# Altium project Module-Wireless.PrjPcb
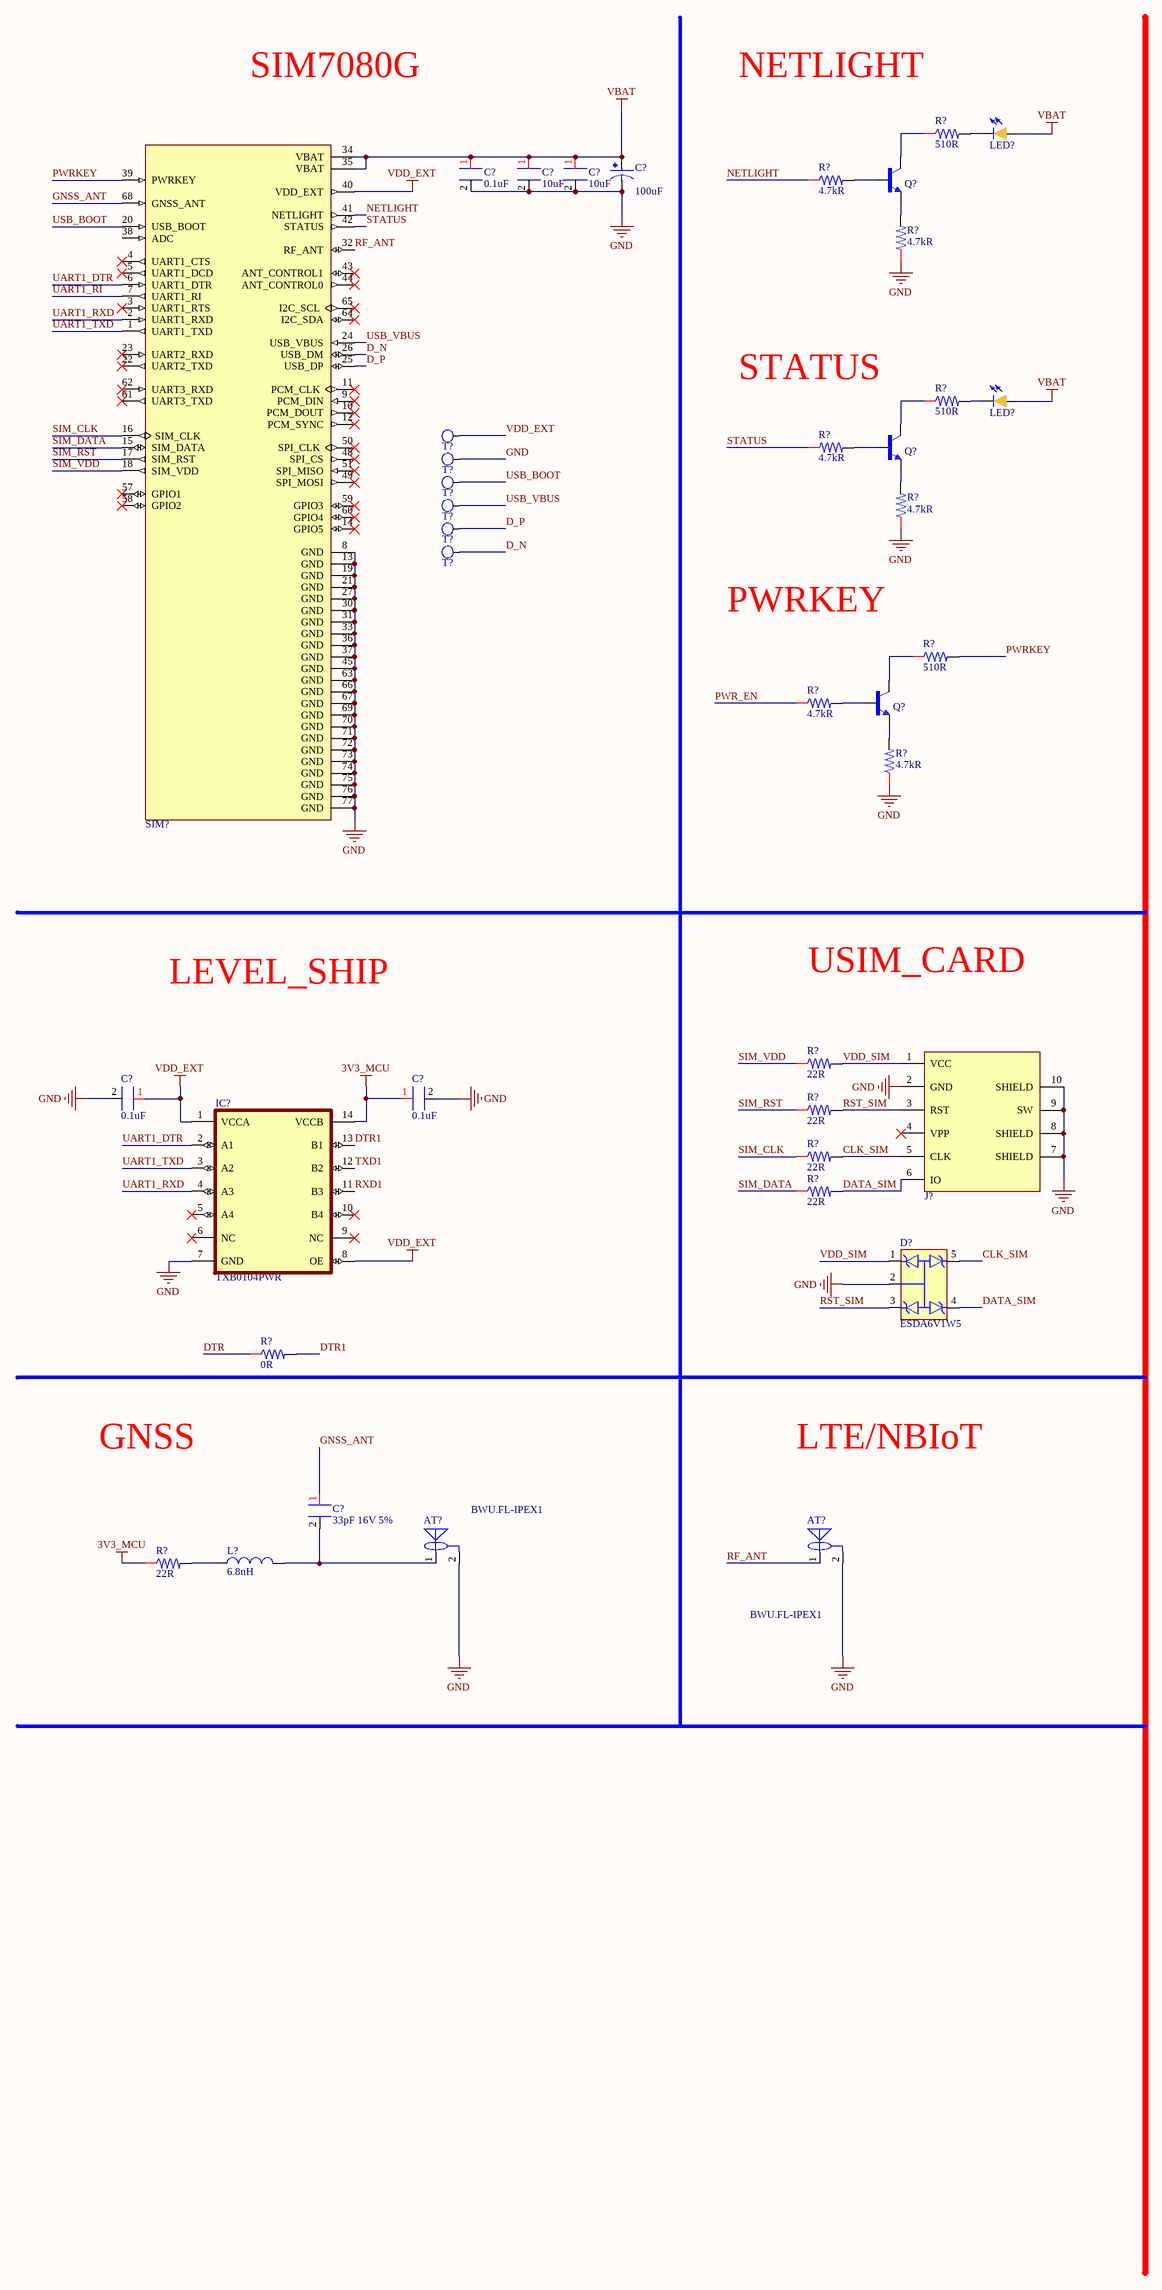
[diagram p0: Module-Wireless.SchDoc]
1 sheet, 40 parts. Net scope: global (net labels, ports and power ports of the same name join across sheets).
Board file: Module-Wireless.PcbDoc

## Sheet Module-Wireless.SchDoc
size D; SheetNumber: 1; SheetTotal: 1

### Parts
(Parts that share a designator on the sheet are numbered #1, #2 ... from top to bottom, then left to right.)
AT?#1  BWU.FL-IPEX1  [IPEX-SMD_BWIPX-1-001E]
AT?#2  BWU.FL-IPEX1  [IPEX-SMD_BWIPX-1-001E]
C?#1  value 0.1uF  [CAP_0603_KEMET]  (hidden comment: 0.1 µF ±20% 50V Ceramic Capacitor X7R 0603 (1608 Metric))
C?#2  value 10uF  [CAP_0603_YAGEO]  (hidden comment: 10 µF ±20% 10V Ceramic Capacitor X5R 0603 (1608 Metric))
C?#3  value 10uF  [CAP_0603_YAGEO]  (hidden comment: 10 µF ±20% 10V Ceramic Capacitor X5R 0603 (1608 Metric))
C?#4  value 100uF  [SMD_DxLxW=6.3x6.6x6.6mm]  (hidden comment: 100 µF 16 V Aluminum Electrolytic Capacitors Radial, Can - SMD 2000 Hrs @ 125°C)
C?#5  value 0.1uF  [CAP_0603_KEMET]  (hidden comment: 0.1 µF ±20% 50V Ceramic Capacitor X7R 0603 (1608 Metric))
C?#6  value 0.1uF  [CAP_0603_KEMET]  (hidden comment: 0.1 µF ±20% 50V Ceramic Capacitor X7R 0603 (1608 Metric))
C?#7  value 33pF 16V 5%  [0603_WURTH ELECTRONIK]  (hidden comment: 885012006020)
D?  Manufacturer Part Number: ESDA6V1W5  [SOT-323-5]  (hidden comment: TVS DIODE 3VWM SOT3235)
IC?  Manufacturer Part Number: TXB0104PWR  [14-TSSOP]  (hidden comment: Voltage Level Translator Bidirectional 1 Circuit 4 Channel 100Mbps 14-TSSOP)
J?  6 Position Card Connector NANO SIM Surface Mount, Right Angle Gold  [NANO-SIM8060]  (value not drawn)
L?  value 6.8nH  [IND_0603_TAIYO_YUDEN]  (hidden comment: 6.8 nH Unshielded Multilayer Inductor 250 mA 390mOhm Max 0201 (0603 Metric))
LED?#1  Yellow-Green 572nm LED Indication - Discrete 2.2V 0603 (1608 Metric)  [LED_0603_ROHM]  (value not drawn)
LED?#2  Yellow-Green 572nm LED Indication - Discrete 2.2V 0603 (1608 Metric)  [LED_0603_ROHM]  (value not drawn)
Q?#1  Bipolar (BJT) Transistor NPN 40 V 200 mA 300MHz 350 mW Surface Mount SOT-23  [SOT-23-3/SC-59]  (value not drawn)
Q?#2  Bipolar (BJT) Transistor NPN 40 V 200 mA 300MHz 350 mW Surface Mount SOT-23  [SOT-23-3/SC-59]  (value not drawn)
Q?#3  Bipolar (BJT) Transistor NPN 40 V 200 mA 300MHz 350 mW Surface Mount SOT-23  [SOT-23-3/SC-59]  (value not drawn)
R?#1  value 510R  [0603_YAGEO]  (hidden comment: 510 Ohms ±1% 0.1W, 1/10W Chip Resistor 0603 (1608 Metric) Moisture Resistant Thick Film)
R?#2  value 4.7kR  [0603_YAGEO]  (hidden comment: 4.7 kOhms ±1% 0.1W, 1/10W Chip Resistor 0603 (1608 Metric) Moisture Resistant Thick Film)
R?#3  value 4.7kR  [0603_YAGEO]  (hidden comment: 4.7 kOhms ±1% 0.1W, 1/10W Chip Resistor 0603 (1608 Metric) Moisture Resistant Thick Film)
R?#4  value 510R  [0603_YAGEO]  (hidden comment: 510 Ohms ±1% 0.1W, 1/10W Chip Resistor 0603 (1608 Metric) Moisture Resistant Thick Film)
R?#5  value 4.7kR  [0603_YAGEO]  (hidden comment: 4.7 kOhms ±1% 0.1W, 1/10W Chip Resistor 0603 (1608 Metric) Moisture Resistant Thick Film)
R?#6  value 4.7kR  [0603_YAGEO]  (hidden comment: 4.7 kOhms ±1% 0.1W, 1/10W Chip Resistor 0603 (1608 Metric) Moisture Resistant Thick Film)
R?#7  value 510R  [0603_YAGEO]  (hidden comment: 510 Ohms ±1% 0.1W, 1/10W Chip Resistor 0603 (1608 Metric) Moisture Resistant Thick Film)
R?#8  value 4.7kR  [0603_YAGEO]  (hidden comment: 4.7 kOhms ±1% 0.1W, 1/10W Chip Resistor 0603 (1608 Metric) Moisture Resistant Thick Film)
R?#9  value 4.7kR  [0603_YAGEO]  (hidden comment: 4.7 kOhms ±1% 0.1W, 1/10W Chip Resistor 0603 (1608 Metric) Moisture Resistant Thick Film)
R?#10  value 22R  [0603_KOA]  (hidden comment: 22 Ohms ±1% 0.1W, 1/10W Chip Resistor 0603 (1608 Metric) Automotive AEC-Q200 Thick Film)
R?#11  value 22R  [0603_KOA]  (hidden comment: 22 Ohms ±1% 0.1W, 1/10W Chip Resistor 0603 (1608 Metric) Automotive AEC-Q200 Thick Film)
R?#12  value 22R  [0603_KOA]  (hidden comment: 22 Ohms ±1% 0.1W, 1/10W Chip Resistor 0603 (1608 Metric) Automotive AEC-Q200 Thick Film)
R?#13  value 22R  [0603_KOA]  (hidden comment: 22 Ohms ±1% 0.1W, 1/10W Chip Resistor 0603 (1608 Metric) Automotive AEC-Q200 Thick Film)
R?#14  value 0R  [0603_YAGEO]  (hidden comment: 0 Ohms Jumper Chip Resistor 0603 (1608 Metric) Moisture Resistant Thick Film)
R?#15  value 22R  [0603_KOA]  (hidden comment: 22 Ohms ±1% 0.1W, 1/10W Chip Resistor 0603 (1608 Metric) Automotive AEC-Q200 Thick Film)
SIM?  RF TXRX MOD CELL NAV SMD  [SIM7080G]  (value not drawn)
T?#1  TP  [TP_TH_1.0/1.5MM]  (value not drawn)  (no BOM)
T?#2  TP  [TP_TH_1.0/1.5MM]  (value not drawn)  (no BOM)
T?#3  TP  [TP_TH_1.0/1.5MM]  (value not drawn)  (no BOM)
T?#4  TP  [TP_TH_1.0/1.5MM]  (value not drawn)  (no BOM)
T?#5  TP  [TP_TH_1.0/1.5MM]  (value not drawn)  (no BOM)
T?#6  TP  [TP_TH_1.0/1.5MM]  (value not drawn)  (no BOM)

### Nets
3V3_MCU: C?#6.1 IC?.14(VCCB) R?#15.1
GND: AT?#1.2 AT?#2.2 C?#1.2 C?#2.2 C?#3.2 C?#4.2 C?#5.2 C?#6.2 D?.2 IC?.7(GND) J?.2(GND) J?.7(SHIELD) J?.8(SHIELD) J?.9(SW) J?.10(SHIELD) R?#3.1 R?#6.1 R?#9.1 SIM?.8(GND) SIM?.13(GND) SIM?.19(GND) SIM?.21(GND) SIM?.27(GND) SIM?.30(GND) SIM?.31(GND) SIM?.33(GND) SIM?.36(GND) SIM?.37(GND) SIM?.45(GND) SIM?.63(GND) SIM?.66(GND) SIM?.67(GND) SIM?.69(GND) SIM?.70(GND) SIM?.71(GND) SIM?.72(GND) SIM?.73(GND) SIM?.74(GND) SIM?.75(GND) SIM?.76(GND) SIM?.77(GND) T?#2.1
VBAT: C?#1.1 C?#2.1 C?#3.1 C?#4.1 LED?#1.A LED?#2.A SIM?.34(VBAT) SIM?.35(VBAT)
VDD_EXT: C?#5.1 IC?.1(VCCA) IC?.8(OE) SIM?.40(VDD_EXT) T?#1.1
CLK_SIM: D?.5 J?.5(CLK) R?#12.2
D_N: SIM?.26(USB_DM) T?#6.1
D_P: SIM?.25(USB_DP) T?#5.1
DATA_SIM: D?.4 J?.6(IO) R?#13.2
DTR: R?#14.1
DTR1: IC?.13(B1) R?#14.2
GNSS_ANT: C?#7.1 SIM?.68(GNSS_ANT)
NETLIGHT: R?#2.1 SIM?.41(NETLIGHT)
PWR_EN: R?#8.1
PWRKEY: R?#7.2 SIM?.39(PWRKEY)
RF_ANT: AT?#2.1 SIM?.32(RF_ANT)
RST_SIM: D?.3 J?.3(RST) R?#11.2
RXD1: IC?.11(B3)
SIM_CLK: R?#12.1 SIM?.16(SIM_CLK)
SIM_DATA: R?#13.1 SIM?.15(SIM_DATA)
SIM_RST: R?#11.1 SIM?.17(SIM_RST)
SIM_VDD: R?#10.1 SIM?.18(SIM_VDD)
STATUS: R?#5.1 SIM?.42(STATUS)
TXD1: IC?.12(B2)
UART1_DTR: IC?.2(A1) SIM?.6(UART1_DTR)
UART1_RI: SIM?.7(UART1_RI)
UART1_RXD: IC?.4(A3) SIM?.2(UART1_RXD)
UART1_TXD: IC?.3(A2) SIM?.1(UART1_TXD)
USB_BOOT: SIM?.20(USB_BOOT) T?#3.1
USB_VBUS: SIM?.24(USB_VBUS) T?#4.1
VDD_SIM: D?.1 J?.1(VCC) R?#10.2
NetAT?#1_1: AT?#1.1 C?#7.2 L?.2
NetL?_1: L?.1 R?#15.2
NetLED?#1_C: LED?#1.C R?#1.2
NetLED?#2_C: LED?#2.C R?#4.2
NetQ?#1_1: Q?#1.1(B) R?#2.2
NetQ?#1_2: Q?#1.2(E) R?#3.2
NetQ?#1_3: Q?#1.3(C) R?#1.1
NetQ?#2_1: Q?#2.1(B) R?#5.2
NetQ?#2_2: Q?#2.2(E) R?#6.2
NetQ?#2_3: Q?#2.3(C) R?#4.1
NetQ?#3_1: Q?#3.1(B) R?#8.2
NetQ?#3_2: Q?#3.2(E) R?#9.2
NetQ?#3_3: Q?#3.3(C) R?#7.1

Not connected (* = marked no-connect by the designer): IC? 5(A4)* 6(NC)* 9(NC)* 10(B4)*; J? 4(VPP)*; SIM? 3(UART1_RTS)* 4(UART1_CTS)* 5(UART1_DCD)* 9(PCM_DIN)* 10(PCM_DOUT)* 11(PCM_CLK)* 12(PCM_SYNC)* 14(GPIO5)* 22(UART2_TXD)* 23(UART2_RXD)* 38(ADC) 43(ANT_CONTROL1)* 44(ANT_CONTROL0)* 48(SPI_CS)* 49(SPI_MOSI)* 50(SPI_CLK)* 51(SPI_MISO)* 57(GPIO1)* 58(GPIO2)* 59(GPIO3)* 60(GPIO4)* 61(UART3_TXD)* 62(UART3_RXD)* 64(I2C_SDA)* 65(I2C_SCL)*

### Notes on the sheet
- SIM7080G
- NETLIGHT
- STATUS
- PWRKEY
- LEVEL_SHIP
- USIM_CARD
- GNSS
- LTE/NBIoT

### Library data of the parts
AT?#1 AT?#2 = BAT WIRELESS BWU.FL-IPEX1: 1 Inner pin IPEX Board-End 1.25mm 6GHz 50Ω 2mm SMD Coaxial Connectors (RF) ROHS; Manufacturer: BAT WIRELESS; Manufacture Part Number: BWU.FL-IPEX1; Packaging: Cut Tape; Link: https://www.lcsc.com/product-detail/Coaxial-Connectors-RF_BAT-WIRELESS-BWU-FL-IPEX1_C5137195.html?s_z=n_IPEX; Package: SMD
C?#1 C?#5 C?#6 = CAP_CER; SMD; 0.1uF; 20%; 25V; 0603; C0603X104M5RAC7867: 0.100UF 50.0V; Manufacturer: KEMET; Library MADE By: Cong Le; Supplier: Digikey; Supplier Part Number: 399-C0603X104M5RAC7867CT-ND; Manufacturer Part Number: C0603X104M5RAC7867; RoHS: Yes; Category: Ceramic Capacitors; Pricing: 1=0.44, 10=0.263, 50=0.1908, 100=0.1685, 500=0.13052, 1000=0.11865 (USD); Manufacture Cross: KEMET; Manufacture Part Number Cross: C0603X104M5RAC7867; ComponentLink1Description: Link Original; ComponentLink1URL: https://www.digikey.com/en/products/detail/kemet/C0603X104M5RAC7867/12082643; ComponentLink2Description: Link Cross; ComponentLink2URL: https://www.lcsc.com/product-detail/Multilayer-Ceramic-Capacitors-MLCC-SMD-SMT_KEMET-C0603X104M5RAC7867_C1865022.html; ComponentLink4Description: Link Viet Nam; ComponentLink4URL: https://www.thegioiic.com/tu-gom-0603-100nf-0-1uf-50v
C?#2 C?#3 = CAP_CER; SMD; 10uF; 20%; 10V; 0603; CC0603MRX5R6BB106: Multilayer Ceramic Capacitor, 10 uF, 10 V, ï¿½ 20%, X5R, 0603 [1608 Metric]; Manufacturer: Yageo; Library MADE By: Cong Le; Supplier: Future Electronics; Supplier Part Number: 2035232; Manufacturer Part Number: CC0603MRX5R6BB106; RoHS: Yes; Category: Ceramic Capacitors; Stock: 100000; Pricing: 4000=0.0211, 12000=0.0197, 16000=0.0202, 20000=0.0194, 40000=0.0196, 60000=0.019, 100000=0.019, 160000=0.0182 (USD); Mounting Technology: Surface Mount; Case/Package: 0603; Case Code (Imperial): 0603; Case Code (Metric): 1608; Weight: 7.1E-05oz; Min Operating Temperature: -55°C; Max Operating Temperature: 85°C; Tolerance: 20%; Packaging: Tape and Reel; Voltage Rating (DC): 10V; Dielectric: X5R; Voltage Rating: 10V; Termination: SMD/SMT; Series: CC; Lead Free: Lead Free; RoHS Compliant: Yes; Halogen Free: 5694HalogenFree; ComponentLink1URL: http://www.mouser.com/ds/2/447/UPY-GPHC_X5R_4V-to-50V_25-1131599.pdf?src-supplier=Mouser; ComponentLink1Description: http://www.mouser.com/ds/2/447/UPY-GPHC_X5R_4V-to-50V_25-1131599.pdf?src-supplier=Mouser; ComponentLink2URL: https://datasheet.octopart.com/CC0603MRX5R6BB106-Yageo-datasheet-158238148.pdf?src-supplier=Newark; ComponentLink2Description: https://datasheet.octopart.com/CC0603MRX5R6BB106-Yageo-datasheet-158238148.pdf?src-supplier=Newark; ComponentLink3URL: http://www.yageo.com/documents/recent/UPY-GPHC_X5R_4V-to-50V_25.pdf?src-supplier=Digikey; ComponentLink3Description: http://www.yageo.com/documents/recent/UPY-GPHC_X5R_4V-to-50V_25.pdf?src-supplier=Digikey; Manufacture Cross: YAGEO; Manufacture Part Number Cross: CC0603MRX5R6BB106; ComponentLink4Description: Link Original; ComponentLink4URL: https://www.digikey.com/en/products/detail/yageo/CC0603MRX5R6BB106/5195224; ComponentLink5Description: Link Cross; ComponentLink5URL: https://www.lcsc.com/product-detail/Multilayer-Ceramic-Capacitors-MLCC-SMD-SMT_YAGEO-CC0603MRX5R6BB106_C109453.html; ComponentLink6Description: Link Viet Nam; ComponentLink6URL: https://www.thegioiic.com/tu-gom-0603-10uf-10v
C?#4 = CAP_ALU; SMD; 100uF; 20%; 16V; DxLxW = 6.3x6.6x6.6 mm; EEE-TPC101XAP: Aluminum Electrolytic Capacitor, 100 uF, 16 V, ± 20%, 2000 hours @ 125°C, Radial Can - SMD; Manufacturer: Panasonic; Manufacture Part Number Cross: EEETPC101XAP; Dielectric Material: Aluminium; Voltage Rating: 16V; Ripple Current: 197mA; ESR (Equivalent Series Resistance): 450mR; Leakage Current: 16uA; Dissipation Factor: 0.23%; Lead Diameter: 0.65mm; Library MADE By: Cong Le; Supplier: Mouser; Supplier Part Number: 667-EEE-TPC101XAP; Manufacturer Part Number: EEE-TPC101XAP; RoHS: Yes; Category: Aluminum Electrolytic Capacitors; Stock: 1234; Pricing: 1=0.75, 10=0.451, 50=0.451, 100=0.344, 500=0.265, 900=0.24, 1000=0.24, 1800=0.217, 9900=0.209, 10000=0.209 (USD); Mounting Technology: Surface Mount,PCB; Case/Package: Radial; Pins: 8; Min Operating Temperature: -40°C; Max Operating Temperature: 125°C; Tolerance: 20%; Impedance: 450mR; Packaging: Tape and Reel; Package Quantity: 900; Ripple Current (AC): 197mA; Voltage Rating (DC): 16V; Life (Hours): 2000Hour; Termination: SMD/SMT; Voltage: 16V; Series: TP; Construction: Cylindrical; Diameter: 6.3mm; Length: 8mm; Height: 7.7mm; Lead Pitch: 1.8mm; Height - Seated (Max): 0.303inch; Radiation Hardening: No; Reach SVHC Compliant: No; Lead Free: Lead Free; RoHS Compliant: Yes; ComponentLink1URL: https://datasheet.ciiva.com/25613/0900766b80f32c70-25613691.pdf?src-supplier=Rs; ComponentLink1Description: https://datasheet.ciiva.com/25613/0900766b80f32c70-25613691.pdf?src-supplier=Rs; ComponentLink2URL: https://datasheet.ciiva.com/6134/437502-6134296.pdf?src-supplier=Farnell; ComponentLink2Description: https://datasheet.ciiva.com/6134/437502-6134296.pdf?src-supplier=Farnell; ComponentLink3URL: https://datasheet.ciiva.com/10331/aba0000ce122-10331147.pdf?src-supplier=Avnet; ComponentLink3Description: https://datasheet.ciiva.com/10331/aba0000ce122-10331147.pdf?src-supplier=Avnet; ComponentLink4URL: https://datasheet.ciiva.com/24069/aba0000ce122-48699-24069737.pdf?src-supplier=Mouser; ComponentLink4Description: https://datasheet.ciiva.com/24069/aba0000ce122-48699-24069737.pdf?src-supplier=Mouser; ComponentLink5URL: https://datasheet.ciiva.com/48540/eeetp-eng-tds-48540924.pdf?src-supplier=Distrelec; ComponentLink5Description: https://datasheet.ciiva.com/48540/eeetp-eng-tds-48540924.pdf?src-supplier=Distrelec; ComponentLink6URL: https://datasheet.ciiva.com/28694/437502-28694937.pdf?src-supplier=Element14; ComponentLink6Description: https://datasheet.ciiva.com/28694/437502-28694937.pdf?src-supplier=Element14; ComponentLink7URL: https://datasheet.ciiva.com/46376/437502-46376838.pdf?src-supplier=Element14; ComponentLink7Description: https://datasheet.ciiva.com/46376/437502-46376838.pdf?src-supplier=Element14; Manufacture Cross: PANASONIC; ComponentLink8Description: Link Original; ComponentLink8URL: https://www.digikey.com/en/products/detail/panasonic-electronic-components/EEE-TPC101XAP/1975582?s=N4IgTCBcDaIDoBcCiKAqAFAwgRgAzYA0BBdEAXQF8g; ComponentLink9Description: Link Cross; ComponentLink9URL: https://www.lcsc.com/product-detail/Aluminum-Electrolytic-Capacitors-SMD_PANASONIC-EEETPC101XAP_C401943.html; ComponentLink10Description: Link Viet Nam; ComponentLink10URL: NA
C?#7 = CAP_CER;SMD; 33pF; 5%; 0603; 16V: WCAP-CSGP General Purpose MLCC; SMT 0603; NP0; 33pF 5%; 16V; -55C to +125C; Tech. PN NP00603330J016DFCT10000; Manufacture: WURTH ELECTRONIK; MP: 885012006020; Link: https://www.snapeda.com/parts/885012006020/Wurth%20Electronics%20Inc/view-part/?ref=search&t=cap%200603%2033pF%20WURTH%20ELECTRONIK; PACKAGE: 0603
D? = DIODE_TVS_4; SMD; 6.1V_break; SOT-323-5; ESDA6V1W5: ESDA Series 4 Channel 6.1V 90 pF SMT Uni-Directional Transil Array - SOT-323-5L; Manufacturer: STMicroelectronics; Direction: Unidirectional; Number of Elements: 4; Value: 90pF; Operating Supply Voltage: 3V; Breakdown Voltage: 7.2V; Peak Pulse Power: 150W; Power Line Protection: No; Leakage Current: 1uA; Test Current: 1mA; ESD Protection: Yes; Peak Pulse Current: 15A; Diode Type: ZENER; Library MADE By: Cong Le; Supplier: Arrow Electronics; Supplier Part Number: ESDA6V1W5; RoHS: Yes; Category: TVS Diodes; Stock: 15000; Pricing: 6000=0.1367 (USD); Mounting Technology: Surface Mount; Case/Package: SOT-323; Pins: 5; Min Operating Temperature: -40°C; Max Operating Temperature: 125°C; Packaging: Tape and Reel; Reverse Breakdown Voltage: 6.1V; Package Quantity: 1; Polarity: Unidirectional; Number of Channels: 4; Termination: SMD/SMT; Number of Unidirectional Channels: 4; Reverse Standoff Voltage: 3V; Min Breakdown Voltage: 6.1V; Working Voltage: 3V; Max Reverse Leakage Current: 1uA; Max Breakdown Voltage: 7.2V; Voltage Rating (DC): 6.1V; Series: ESDA, TRANSIL™; Length: 2.2mm; Width: 1.35mm; Height: 1mm; Depth: 1.35mm; Radiation Hardening: No; RoHS Compliant: Yes; Reach SVHC Compliant: No; Lead Free: Lead Free; ComponentLink1URL: https://datasheet.ciiva.com/15143/getdatasheetpartid-134557-15143650.pdf?src-supplier=Verical; ComponentLink1Description: https://datasheet.ciiva.com/15143/getdatasheetpartid-134557-15143650.pdf?src-supplier=Verical; ComponentLink2URL: https://datasheet.ciiva.com/1276/1671027-1276908.pdf?src-supplier=Element14; ComponentLink2Description: https://datasheet.ciiva.com/1276/1671027-1276908.pdf?src-supplier=Element14; ComponentLink3URL: https://datasheet.ciiva.com/22695/1671027-22695673.pdf?src-supplier=Element14; ComponentLink3Description: https://datasheet.ciiva.com/22695/1671027-22695673.pdf?src-supplier=Element14; ComponentLink4URL: https://datasheet.ciiva.com/338/cd00064033-338380.pdf?src-supplier=Digikey; ComponentLink4Description: https://datasheet.ciiva.com/338/cd00064033-338380.pdf?src-supplier=Digikey; ComponentLink5URL: https://datasheet.ciiva.com/338/cd00064033-338379.pdf?src-supplier=Digikey; ComponentLink5Description: https://datasheet.ciiva.com/338/cd00064033-338379.pdf?src-supplier=Digikey; ComponentLink6URL: https://datasheet.ciiva.com/338/cd00064033-338381.pdf?src-supplier=Digikey; ComponentLink6Description: https://datasheet.ciiva.com/338/cd00064033-338381.pdf?src-supplier=Digikey; ComponentLink7URL: https://datasheet.ciiva.com/41443/001184222-da-01-en-transil-array-da-esda6v1w5-sot-323-5-stm-41443642.pdf?src-supplier=Conrad; ComponentLink7Description: https://datasheet.ciiva.com/41443/001184222-da-01-en-transil-array-da-esda6v1w5-sot-323-5-stm-41443642.pdf?src-supplier=Conrad; Manufacture Part Number Cross: *; Manufacture Cross: *; ComponentLink8Description: Link Viet Nam; ComponentLink8URL: https://linhkien.cxtvn.com/4502-esda6v1w5.html; ComponentLink9Description: Link Cross; ComponentLink9URL: *; ComponentLink10Description: Link Original; ComponentLink10URL: https://www.digikey.com/en/products/detail/stmicroelectronics/ESDA6V1W5/1037992?s=N4IgTCBcDaIKIGUAiBBAbANQIwHUCsIAugL5A
IC? = IC_LEVEL_SHIP; SMD; 1.8 to 3V; 14-TSSOP; TXB0104PWR: 4-Bit Bidirectional Voltage-Level Shifter with Auto Direction Sensing and +/-15 kV ESD Protect 14-TSSOP -40 to 85; Manufacturer: Texas Instruments; Nominal Supply Current: 5uA; Number of Circuits: 1NUMBER; Min Supply Voltage (DC): 1.2V; Number of Outputs: 4NUMBER; Library MADE By: Cong Le; Supplier: Mouser; Supplier Part Number: 595-TXB0104PWR; RoHS: Yes; Category: Voltage Level Shifters; Stock: 10198; Pricing: 1=0.87, 10=0.619, 25=0.558, 50=0.558, 100=0.491, 250=0.458, 500=0.439, 1000=0.41, 2000=0.41, 4000=0.393, 10000=0.393 (USD); Thickness: 1mm; Lead Free: 5697LeadFree; RoHS Compliant: 5897YesNo; ComponentLink1URL: https://datasheet.ciiva.com/15096/getdatasheetpartid-48026-15096134.pdf?src-supplier=Verical; ComponentLink1Description: https://datasheet.ciiva.com/15096/getdatasheetpartid-48026-15096134.pdf?src-supplier=Verical; ComponentLink2URL: https://datasheet.ciiva.com/22653/1845221-22653354.pdf?src-supplier=Farnell; ComponentLink2Description: https://datasheet.ciiva.com/22653/1845221-22653354.pdf?src-supplier=Farnell; ComponentLink3URL: https://datasheet.ciiva.com/1508/1633692-1508723.pdf?src-supplier=Element14; ComponentLink3Description: https://datasheet.ciiva.com/1508/1633692-1508723.pdf?src-supplier=Element14; ComponentLink4URL: https://datasheet.ciiva.com/1899/txb0104-1899514.pdf?src-supplier=Digikey; ComponentLink4Description: https://datasheet.ciiva.com/1899/txb0104-1899514.pdf?src-supplier=Digikey; ComponentLink5URL: https://datasheet.ciiva.com/1899/txb0104-1899515.pdf?src-supplier=Digikey; ComponentLink5Description: https://datasheet.ciiva.com/1899/txb0104-1899515.pdf?src-supplier=Digikey; ComponentLink6URL: https://datasheet.ciiva.com/1899/txb0104-1899516.pdf?src-supplier=Digikey; ComponentLink6Description: https://datasheet.ciiva.com/1899/txb0104-1899516.pdf?src-supplier=Digikey; ComponentLink7URL: https://datasheet.ciiva.com/14287/txb0104-14287375.pdf?src-supplier=Avnet; ComponentLink7Description: https://datasheet.ciiva.com/14287/txb0104-14287375.pdf?src-supplier=Avnet; ComponentLink8URL: https://datasheet.ciiva.com/46395/1864432-46395886.pdf?src-supplier=Element14; ComponentLink8Description: https://datasheet.ciiva.com/46395/1864432-46395886.pdf?src-supplier=Element14; ComponentLink9URL: https://datasheet.ciiva.com/1508/1849862-1508724.pdf?src-supplier=Element14; ComponentLink9Description: https://datasheet.ciiva.com/1508/1849862-1508724.pdf?src-supplier=Element14; Manufacture Part Number Cross: *; Manufacture Cross: *; ComponentLink10Description: Link Viet Nam; ComponentLink10URL: https://banlinhkiendientu.vn/txb0104pwr-txb0104-ye04-tssop-14/?srsltid=AfmBOoruaf57WFTpsiyGcYk6y5D2ILLruoPnWpg9IcFdTIndHb1-I7Ap; ComponentLink11Description: Link Cross; ComponentLink11URL: *; ComponentLink12Description: Link Original; ComponentLink12URL: https://www.digikey.com/en/products/detail/texas-instruments/TXB0104PWR/1629102
J? = SOCKET_SIM; SIM8060-6-1-14-00-A: 6 Position Right Angle Surface Mount NANO SIM Card Connector; Manufacturer: Global Connector Technology; Manufacture Cross: GCT; Designer: TVBac; Library MADE By: Cong Le; Supplier: Digikey; Supplier Part Number: 2073-SIM8060-6-1-14-00-ACT-ND; Manufacturer Part Number: SIM8060-6-1-14-00-A; RoHS: No; Category: Connectors; Stock: 11694; Pricing: 1=1.44, 10=1.217, 25=1.1676, 50=1.143, 100=1.0932, 250=0.99384, 500=0.89446 (USD); ComponentLink1URL: https://datasheet.octopart.com/SIM8060-6-1-14-00-A-Global-Connector-Technology-datasheet-128083790.pdf?src-supplier=Future+Electronics; ComponentLink1Description: https://datasheet.octopart.com/SIM8060-6-1-14-00-A-Global-Connector-Technology-datasheet-128083790.pdf?src-supplier=Future+Electronics; ComponentLink2URL: https://gct.co/files/drawings/sim8060.pdf?src-supplier=Digikey; ComponentLink2Description: https://gct.co/files/drawings/sim8060.pdf?src-supplier=Digikey; ComponentLink3Description: Link Original; ComponentLink3URL: https://www.digikey.com/en/products/detail/gct/SIM8060-6-1-14-00-A/10127235; ComponentLink4Description: Link Cross; ComponentLink4URL: https://www.lcsc.com/product-detail/span-style-background-color-ff0-SIM-span-Card-Connectors_Global-Connector-Technology-SIM8060-6-1-14-00-A_C2943124.html; ComponentLink5Description: Link Viet Nam; ComponentLink5URL: https://shopee.vn/5-c%C3%A1i-Socket-khe-khay-c%E1%BA%AFm-micro-SIM-6P-8P-n%E1%BA%AFp-s%E1%BA%AFt-kde5392-i.49119859.2216312524?sp_atk=ad505d5b-ad20-49c7-9730-b59bf6002195&xptdk=ad505d5b-ad20-49c7-9730-b59bf6002195; Manufacture Part Number Cross: SIM8060-6-1-14-00-A
L? = IND: SMD: 6.8nH; 0.25A; 0603; HK06036N8J-T: Ind High Frequency Chip Multi-Layer 6.8nH 5% 100MHz 5Q-Factor Ceramic 250mA 0201 T/R; Manufacturer: Taiyo Yuden; Library MADE By: Cong Le; Supplier: Avnet; Supplier Part Number: HK06036N8J-T; Manufacturer Part Number: HK06036N8J-T; RoHS: Yes; Category: Fixed Inductors; Stock: 15000; Pricing: 15000=0.01446 (USD); ComponentLink1URL: https://datasheet.ciiva.com/1038/hk06036n8j-t-ss-1038220.pdf?src-supplier=Digikey; ComponentLink1Description: https://datasheet.ciiva.com/1038/hk06036n8j-t-ss-1038220.pdf?src-supplier=Digikey; ComponentLink2URL: https://datasheet.ciiva.com/8503/hk06036n8j-t-ss-8503694.pdf?src-supplier=Avnet; ComponentLink2Description: https://datasheet.ciiva.com/8503/hk06036n8j-t-ss-8503694.pdf?src-supplier=Avnet; ComponentLink3URL: https://datasheet.ciiva.com/30245/359hk06036n8j-t-30245573.pdf?src-supplier=Onlinecomponents.com; ComponentLink3Description: https://datasheet.ciiva.com/30245/359hk06036n8j-t-30245573.pdf?src-supplier=Onlinecomponents.com; ComponentLink4URL: https://datasheet.ciiva.com/15986/283hk06036n8j-t-15986283.pdf?src-supplier=Onlinecomponents.com; ComponentLink4Description: https://datasheet.ciiva.com/15986/283hk06036n8j-t-15986283.pdf?src-supplier=Onlinecomponents.com; Manufacture Part Number Cross: *; Manufacture Cross: *; ComponentLink5Description: Link Viet Nam; ComponentLink5URL: https://dientutuonglai.com/cuon-cam-smd-68nh-0603.html; ComponentLink6Description: Link Cross; ComponentLink6URL: *; ComponentLink7Description: Link Original; ComponentLink7URL: https://www.digikey.com/en/products/detail/taiyo-yuden/HK06036N8J-T/957875
LED?#1 LED?#2 = LED_YELOW; SMD; 0603; SML-D12M1WT86: LED Uni-Color Yellow Green 2-Pin Chip 0603(1608Metric) T/R; Manufacturer: Rohm; Manufacture Cross: ROHM Semicon; Forward Current: 20mA; Power Dissipation: 54mW; Reverse Voltage: 5V; Library MADE By: Cong Le; Supplier: Digikey; Supplier Part Number: SML-D12M1WT86CT-ND; Manufacturer Part Number: SML-D12M1WT86; RoHS: Yes; Category: LEDs; Stock: 114320; Pricing: 1=0.21, 10=0.116, 100=0.0689, 500=0.05074, 1000=0.04519 (USD); Min Operating Temperature: -40°C; Max Operating Temperature: 85°C; Wavelength: 572nm; Lead Free: 5697LeadFree; ComponentLink1URL: https://datasheet.octopart.com/SML-D12M1WT86-Rohm-datasheet-138791993.pdf?src-supplier=Future+Electronics; ComponentLink1Description: https://datasheet.octopart.com/SML-D12M1WT86-Rohm-datasheet-138791993.pdf?src-supplier=Future+Electronics; ComponentLink2URL: https://www.rohm.com/datasheet/SML-D12M1W?src-supplier=Digikey; ComponentLink2Description: https://www.rohm.com/datasheet/SML-D12M1W?src-supplier=Digikey; ComponentLink3URL: https://datasheet.octopart.com/SML-D12M1WT86-Rohm-datasheet-142144710.pdf?src-supplier=TME; ComponentLink3Description: https://datasheet.octopart.com/SML-D12M1WT86-Rohm-datasheet-142144710.pdf?src-supplier=TME; Manufacture Part Number Cross: ROHM Semicon; ComponentLink4Description: Link Original; ComponentLink4URL: https://www.digikey.com/en/products/detail/rohm-semiconductor/sml-d12m1wt86/5843856; ComponentLink5Description: Link Cross; ComponentLink5URL: https://www.lcsc.com/product-detail/LED-Indication-Discrete_ROHM-Semicon-SML-D12M1WT86_C2922668.html; ComponentLink6Description: Link Viet Nam; ComponentLink6URL: https://linhkienviet.vn/led-0603-vang
Q?#1-Q?#3 = TRANSISTOR_BJT; SMD; 40V; 200mA; SOT-23-3MMBT3904-TP: Manufacturer: MCC; Manufacture Cross: Micro Commercial Co; Collector Emitter Voltage (VCEO): 40V; Max Power Dissipation: 350mW; Number of Elements: 1; hFE Min: 40; Max Collector Current: 200mA; Collector Base Voltage (VCBO): 60V; Emitter Base Voltage (VEBO): 6V; Collector Emitter Saturation Voltage: 300mV; Current Rating: 100mA; Library MADE By: Cong Le; Supplier: Digikey; Supplier Part Number: MMBT3904TPMSCT-ND; Manufacturer Part Number: MMBT3904-TP; RoHS: Yes; Category: BJTs; Stock: 1893660; Pricing: 1=0.1, 10=0.068, 100=0.0369, 500=0.02898, 1000=0.02012 (USD); Mounting Technology: Surface Mount; Case/Package: SOT-23; Pins: 3; Min Operating Temperature: -55°C; Max Operating Temperature: 150°C; Package Quantity: 1; Packaging: Tape and Reel; Frequency: 300MHz; Transition Frequency: 300MHz; Collector Emitter Breakdown Voltage: 40V; Polarity: NPN; Max Breakdown Voltage: 40V; Power Dissipation: 350mW; Clock Frequency: 300MHz; Gain Bandwidth Product: 300MHz; Voltage Rating (DC): 40V; Series: -; Collector-emitter Voltage-Max: 300mV; Length: 3.04mm; Width: 1.4mm; Height: 1.12mm; Radiation Hardening: No; RoHS Compliant: Yes; Lead Free: 5697LeadFree; ComponentLink1URL: https://datasheet.ciiva.com/972/mmbt3904sot-23-972515.pdf?src-supplier=Digikey; ComponentLink1Description: https://datasheet.ciiva.com/972/mmbt3904sot-23-972515.pdf?src-supplier=Digikey; ComponentLink2URL: https://datasheet.ciiva.com/15139/getdatasheetpartid-251950-15139820.pdf?src-supplier=Verical; ComponentLink2Description: https://datasheet.ciiva.com/15139/getdatasheetpartid-251950-15139820.pdf?src-supplier=Verical; ComponentLink3URL: https://datasheet.ciiva.com/16291/mmbt3904sot-23-37005-16291911.pdf?src-supplier=Mouser; ComponentLink3Description: https://datasheet.ciiva.com/16291/mmbt3904sot-23-37005-16291911.pdf?src-supplier=Mouser; ComponentLink4URL: https://datasheet.ciiva.com/972/mmbt3904sot-23-972516.pdf?src-supplier=Digikey; ComponentLink4Description: https://datasheet.ciiva.com/972/mmbt3904sot-23-972516.pdf?src-supplier=Digikey; ComponentLink5URL: https://datasheet.ciiva.com/14546/70055699-14546053.pdf?src-supplier=Allied+Electronics; ComponentLink5Description: https://datasheet.ciiva.com/14546/70055699-14546053.pdf?src-supplier=Allied+Electronics; ComponentLink6URL: https://datasheet.ciiva.com/16742/mmbt3904tsot-523-16742101.pdf?src-supplier=Future+Electronics; ComponentLink6Description: https://datasheet.ciiva.com/16742/mmbt3904tsot-523-16742101.pdf?src-supplier=Future+Electronics; ComponentLink7Description: Link Original; ComponentLink7URL: https://www.digikey.com/en/products/detail/micro-commercial-co/MMBT3904-TP/717280; ComponentLink8Description: Link Cross; ComponentLink8URL: https://www.lcsc.com/product-detail/Bipolar-BJT_MCC-Micro-Commercial-Components-MMBT3904-TP_C77991.html; ComponentLink9Description: Link Viet Nam; ComponentLink9URL: NA; Manufacture Part Number Cross: MMBT3904-TP
R?#1 R?#4 R?#7 = RES; SMD; 510R; 1%; 0603; 1/10W; RC0603FR-07510RL: 100Mw Thick Film Resistors 100Ppm/ 1% 510 0603 Chip Resistor Surface Mount Rohs; Manufacturer: Yageo; Temperature Coefficient: 100ppm/°C; Voltage Rating: 75V; Voltage Rating (DC): 50V; Library MADE By: Cong Le; Supplier: Newark; Supplier Part Number: 21AM7137; Manufacturer Part Number: RC0603FR-07510RL; RoHS: Yes; Category: Chip SMD Resistors; Case/Package: 0603; Pins: 2; Contact Plating: Tin,Matte; Case Code (Imperial): 0603; Weight: 7.1E-05oz; Case Code (Metric): 1608; Min Operating Temperature: -55°C; Max Operating Temperature: 155°C; Tolerance: 1%; Power Rating: 100mW; Packaging: Tape and Reel; Termination: SMD/SMT; Resistor Type: Thick Film; Features: Moisture Resistant; Series: RC; Max Power Dissipation: 100mW; Number of Terminations: 2; Resistance Tolerance: 1%; Technology: THICK FILM; Length: 1.6mm; Width: 0.8mm; Height: 0.45mm; Depth: 0.8mm; Reach SVHC Compliant: No; Lead Free: 5697LeadFree; RoHS Compliant: Yes; ComponentLink1URL: https://datasheet.ciiva.com/11808/0900766b80f96399-11808268.pdf?src-supplier=Rs; ComponentLink1Description: https://datasheet.ciiva.com/11808/0900766b80f96399-11808268.pdf?src-supplier=Rs; ComponentLink2URL: https://datasheet.ciiva.com/46395/443971-46395013.pdf?src-supplier=Element14; ComponentLink2Description: https://datasheet.ciiva.com/46395/443971-46395013.pdf?src-supplier=Element14; ComponentLink3URL: https://datasheet.ciiva.com/8883/pyu-rc0603-51-rohs-l-4-8883078.pdf?src-supplier=Avnet; ComponentLink3Description: https://datasheet.ciiva.com/8883/pyu-rc0603-51-rohs-l-4-8883078.pdf?src-supplier=Avnet; Manufacture Part Number Cross: *; Manufacture Cross: *; ComponentLink4Description: Link Viet Nam; ComponentLink4URL: https://linhkienchatluong.vn/dien-tro-dan-0603-116w-1/dien-tro-dan-0603-510r-1-50c_sp836_ct8908.aspx; ComponentLink5Description: Link Cross; ComponentLink5URL: *; ComponentLink6Description: Link Original; ComponentLink6URL: https://www.digikey.com/en/products/detail/yageo/RC0603FR-07510RL/727285?s=N4IgTCBcDaIEoGEAMA2JBmAYnAtEg7AKwCMScAMiALoC%2BQA
R?#2 R?#3 R?#5 R?#6 R?#8 R?#9 = RES; SMD; 4.7K; 1%; 1/10W; 0603; RC0603FR-074K7L: SMD Chip Resistor, 4.7 kOhm, ï¿½ 1%, 100 mW, 0603 [1608 Metric], Thick Film, General Purpose; Manufacturer: Yageo; Power Rating: 100mW; Voltage Rating (DC): 50V; Temperature Coefficient: 100ppm/°C; Library MADE By: Cong Le; Supplier: Digikey; Supplier Part Number: 311-4.70KHRCT-ND; Manufacturer Part Number: RC0603FR-074K7L; RoHS: Yes; Category: Chip SMD Resistors; Stock: 2341269; Pricing: 1=0.1, 10=0.019, 50=0.0112, 100=0.0093, 500=0.00622, 1000=0.00532, 5000=0.00382, 10000=0.00335, 25000=0.00287, 35000=0.00278, 50000=0.00257, 125000=0.00232 (USD); Case/Package: 0603; Pins: 2; Case Code (Imperial): 0603; Case Code (Metric): 1608; Min Operating Temperature: -55°C; Max Operating Temperature: 155°C; Tolerance: 1%; Resistor Type: Thick Film; Packaging: Tape and Reel; Voltage Rating: 50V; Termination: SMD/SMT; Features: Moisture Resistant; Series: RC; Max Power Dissipation: 100mW; Number of Terminations: 2; Construction: Rectangular; Resistance Tolerance: 1%; Length: 1.6mm; Width: 0.8mm; Depth: 0.8mm; Lead Pitch: 0.3mm; RoHS Compliant: Yes; Reach SVHC Compliant: Unknown; Lead Free: 5697LeadFree; Military Standard: Not; ComponentLink1URL: https://datasheet.ciiva.com/15189/getdatasheetpartid-422754-15189760.pdf?src-supplier=Verical; ComponentLink1Description: https://datasheet.ciiva.com/15189/getdatasheetpartid-422754-15189760.pdf?src-supplier=Verical; ComponentLink2URL: https://datasheet.ciiva.com/7660/38590-7660794.pdf?src-supplier=Element14; ComponentLink2Description: https://datasheet.ciiva.com/7660/38590-7660794.pdf?src-supplier=Element14; ComponentLink3URL: https://datasheet.ciiva.com/22747/443971-22747528.pdf?src-supplier=Element14; ComponentLink3Description: https://datasheet.ciiva.com/22747/443971-22747528.pdf?src-supplier=Element14; ComponentLink4URL: https://datasheet.ciiva.com/46440/1868787-46440909.pdf?src-supplier=Element14; ComponentLink4Description: https://datasheet.ciiva.com/46440/1868787-46440909.pdf?src-supplier=Element14; ComponentLink5URL: https://datasheet.ciiva.com/7746/1868787-7746365.pdf?src-supplier=Element14; ComponentLink5Description: https://datasheet.ciiva.com/7746/1868787-7746365.pdf?src-supplier=Element14; ComponentLink6URL: https://datasheet.ciiva.com/7746/1738695-7746366.pdf?src-supplier=Element14; ComponentLink6Description: https://datasheet.ciiva.com/7746/1738695-7746366.pdf?src-supplier=Element14; ComponentLink7Description: Link Original; ComponentLink7URL: https://www.digikey.com/en/products/detail/yageo/RC0603FR-074K7L/727212; Manufacture Cross: YAGEO; Manufacture Part Number Cross: RC0603FR-074K7L; ComponentLink8Description: Link Cross; ComponentLink8URL: https://www.lcsc.com/product-detail/Chip-Resistor-Surface-Mount_YAGEO-RC0603FR-074K7L_C99782.html; ComponentLink9Description: Link Viet Nam; ComponentLink9URL: https://linhkienchatluong.vn/dien-tro-dan-0603-116w-1/dien-tro-dan-0603-47k-1-50c_sp836_ct5784.aspx
R?#10-R?#13 R?#15 = RES; SMD; 22R; 1%; 1/8W; 0603; RK73H1JTTD22R0F: Res Thick Film 0603 22 Ohm 1% 0.125W(1/8W) +/-100ppm/ßC Pad SMD Automotive T/R; Manufacturer: KOA Speer; Manufacture Cross: KOA Speer Electronics, Inc.; Power Rating: 100mW; Voltage Rating: 50V; Temperature Coefficient: 100ppm/°C; Max Power Dissipation: 125mW; Library MADE By: Cong Le; Supplier: Digikey; Supplier Part Number: 2019-RK73H1JTTD22R0FCT-ND; Manufacturer Part Number: RK73H1JTTD22R0F; RoHS: Yes; Category: Chip SMD Resistors; Stock: 224262; Pricing: 1=0.1, 10=0.021, 50=0.013, 100=0.0108, 500=0.00734, 1000=0.00631, 5000=0.00458, 10000=0.00406, 25000=0.00348, 35000=0.00338, 50000=0.00314, 125000=0.00285 (USD); Case/Package: 0603; Pins: 2; Case Code (Imperial): 0603; Case Code (Metric): 1608; Min Operating Temperature: -55°C; Max Operating Temperature: 155°C; Tolerance: 1%; Packaging: Tape and Reel; Package Quantity: 5000; Resistor Type: Thick Film; Termination: SMD/SMT; Voltage Rating (DC): 50V; Series: RK73H; Resistance Tolerance: 1%; Features: Moisture Resistant,Automotive AEC-Q200; Number of Terminations: 2; Length: 1.6mm; Width: 0.8mm; Height: 0.45mm; Ratings: AEC-Q200; Lead Free: Lead Free; RoHS Compliant: Yes; ComponentLink1URL: https://datasheet.ciiva.com/48426/rk73h-series-eng-jap-tds-48426569.pdf?src-supplier=Distrelec; ComponentLink1Description: https://datasheet.ciiva.com/48426/rk73h-series-eng-jap-tds-48426569.pdf?src-supplier=Distrelec; ComponentLink2URL: https://datasheet.ciiva.com/5553/rk73h-5715-5553511.pdf?src-supplier=Mouser; ComponentLink2Description: https://datasheet.ciiva.com/5553/rk73h-5715-5553511.pdf?src-supplier=Mouser; Manufacture Part Number Cross: RK73H1JTTD22R0F; ComponentLink3Description: Link Original; ComponentLink3URL: https://www.digikey.com/en/products/detail/koa-speer-electronics-inc/RK73H1JTTD22R0F/9844876; ComponentLink4Description: Link Cross; ComponentLink4URL: https://www.lcsc.com/product-detail/Chip-Resistor-Surface-Mount_KOA-Speer-Elec-RK73H1JTTD22R0F_C160030.html; ComponentLink5Description: Link Viet Nam; ComponentLink5URL: https://shopee.vn/%C4%90i%E1%BB%87n-Tr%E1%BB%9F-D%C3%A1n-220-22R-0603-1-8W-(100-con-T%C3%BAi)-i.503475102.12184492244
R?#14 = RES; SMD; 0R; 1/10W; 0603; RC0603JR-070RL: GENERAL PURPOSE CHIP RESISTOR Metal Glaze/thick Film, 0.1W, 0ohm, Surface Mount, 0603; Manufacturer: Yageo; Tolerance: 1%; Power Rating: 100mW; Voltage Rating (DC): 50V; Temperature Coefficient: 200ppm/°C; Resistance Tolerance: 5%; Library MADE By: Cong Le; Supplier: Future Electronics; Supplier Part Number: 3992146; Manufacturer Part Number: RC0603JR-070RL; RoHS: Yes; Category: Chip SMD Resistors; Stock: 11810000; Pricing: 5000=0.0015, 50000=0.0014, 75000=0.0014, 150000=0.0013, 250000=0.0014, 375000=0.0013, 750000=0.0013, 1000000=0.0012, 2500000=0.0012 (USD); Case/Package: 0603; Pins: 2; Contact Plating: Tin,Matte; Case Code (Imperial): 0603; Case Code (Metric): 1608; Min Operating Temperature: -55°C; Max Operating Temperature: 155°C; Resistor Type: Thick Film; Packaging: Tape and Reel; Termination: SMD/SMT; Series: RC; Technology: THICK FILM; Package Quantity: 5000; Voltage Rating: 50V; Features: Moisture Resistant; Max Power Dissipation: 100mW; Number of Terminations: 2; Construction: Rectangular; Length: 1.6mm; Width: 0.8mm; Height: 0.45mm; Depth: 0.8mm; Reach SVHC Compliant: Unknown; Lead Free: 5697LeadFree; RoHS Compliant: Yes; Military Standard: Not; Manufacture Cross: YAGEO; Manufacture Part Number Cross: RC0603JR-070RL; ComponentLink1Description: Link Original; ComponentLink1URL: https://www.digikey.com/en/products/detail/yageo/RC0603JR-070RL/726675; ComponentLink2Description: Link Cross; ComponentLink2URL: https://www.lcsc.com/product-detail/Chip-Resistor-Surface-Mount_YAGEO-RC0603JR-070RL_C95177.html; ComponentLink3Description: Link Viet Nam; ComponentLink3URL: https://cungcaplinhkien.vn/dien-tro-dan-0k-0603-5-cuon-5000pcs
SIM? = SIM7080G: CAT-M and NB-IoT Module 600MHz/700MHz/800MHz/850MHz/900MHz/1700MHz/1800MHz/1900MHz/2100MHz 2.7V to 4.8V LCC+LGA; Manufacturer: Simcom; Library MADE By: Cong Le; Supplier: Digikey; Supplier Part Number: 3781-SIM7080G-ND; Manufacturer Part Number: SIM7080G; RoHS: No; Category: LDO; Stock: 865; Pricing: 1=22.62, 10=19.724, 25=18.7208, 100=17.3446, 250=16.52136, 500=15.94076 (USD); Manufacture Cross: *; Manufacture Part Number Cross: *; ComponentLink1Description: Link Original; ComponentLink1URL: https://www.digikey.com/en/products/detail/simcom-wireless-solutions-limited/SIM7080G/15841448; ComponentLink2Description: Link Cross; ComponentLink2URL: *; ComponentLink3Description: Link Viet Nam; ComponentLink3URL: https://linhkien.cxtvn.com/6535-sim7080g-cat-mnb-iot.html
T?#1-T?#6 = TESTPOINT: Test point; Label: 5V; Library MADE By: Cong Le